# Altium schematic sheet MotorControl.back.SchDoc
size A
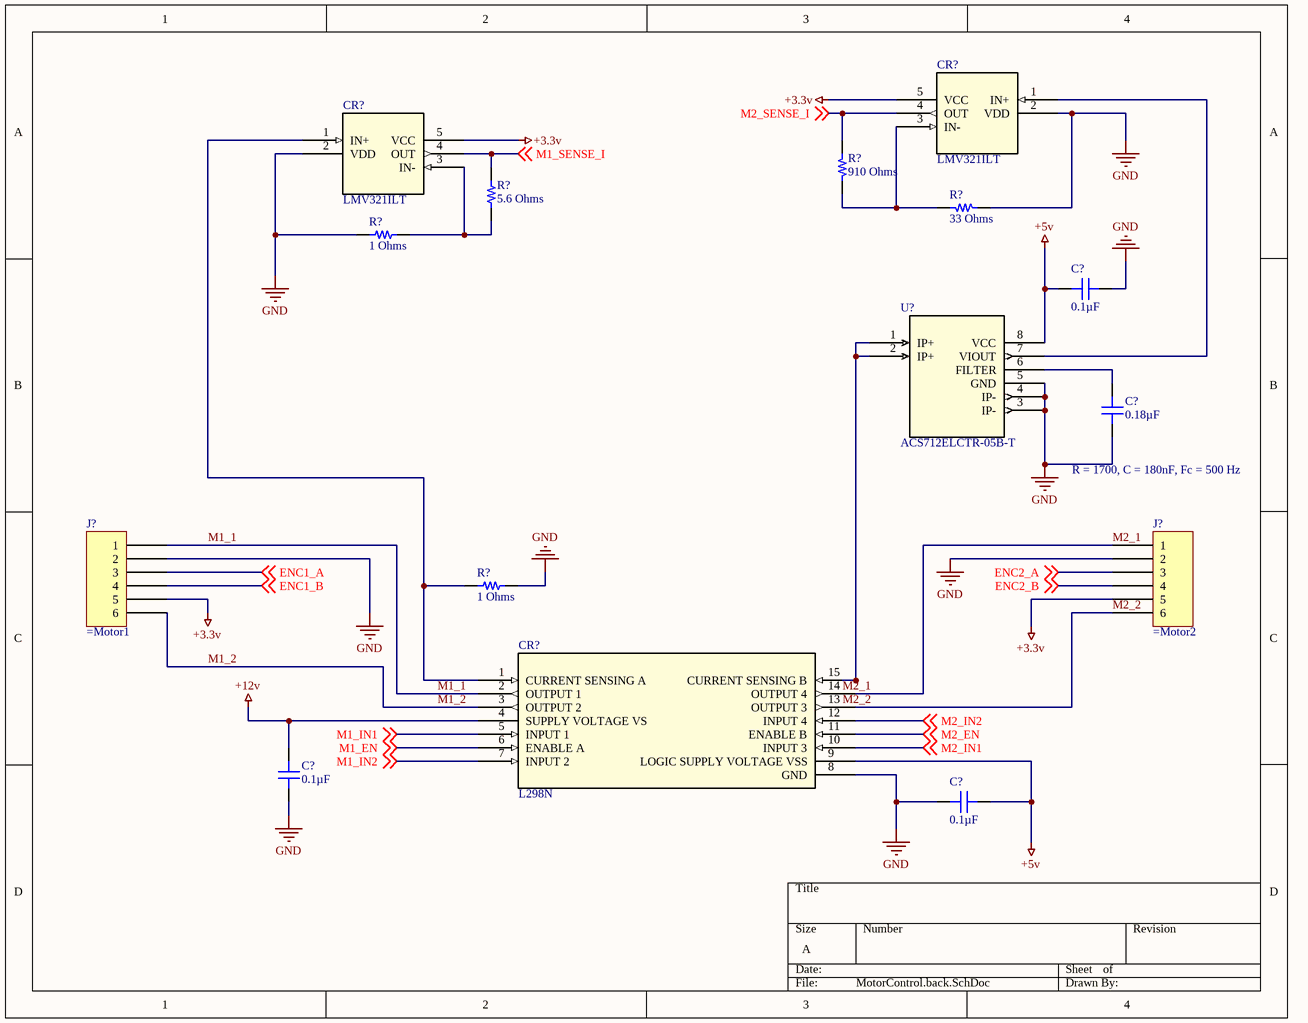
[diagram p0: MotorControl.back.SchDoc]

## Parts
(Parts that share a designator on the sheet are numbered #1, #2 ... from top to bottom, then left to right.)
C?#1  0.1µF  [CAP 0805_2012]
C?#2  0.18µF  [CAP 0805_2012]
C?#3  0.1µF  [CAP 0805_2012]
C?#4  0.1µF  [CAP 0805_2012]
CR?#1  LMV321ILT  [SOT23-5_STM]
CR?#2  LMV321ILT  [SOT23-5_STM]
CR?#3  L298N  [Multiwatt15_V_STM]
J?#1  (no value)  [MOLEX KK 0022272061]
J?#2  (no value)  [MOLEX KK 0022272061]
R?#1  910 Ohms  [RES 0805_2012]
R?#2  5.6 Ohms  [RES 0805_2012]
R?#3  33 Ohms  [RES 0805_2012]
R?#4  1 Ohms  [RES 0805_2012]
R?#5  1 Ohms  [RES 2512_6432]
U?  ACS712ELCTR-05B-T  [SOIC-8_ALM]

## Nets
+3.3v: CR?#1.5(VCC) CR?#2.5(VCC) J?#1.5 J?#2.5
+5v: C?#1.2 C?#4.2 CR?#3.9(LOGIC_SUPPLY_VOLTAGE_VSS) U?.8(VCC)
+12v: C?#3.2 CR?#3.4(SUPPLY_VOLTAGE_VS)
GND: C?#1.1 C?#2.1 C?#3.1 C?#4.1 CR?#1.2(VDD) CR?#2.2(VDD) CR?#3.8(GND) J?#1.2 J?#2.2 R?#3.2 R?#4.1 R?#5.1 U?.3(IP-) U?.4(IP-) U?.5(GND)
ENC1_A: J?#1.3 ; off-sheet ENC1_A
ENC1_B: J?#1.4 ; off-sheet ENC1_B
ENC2_A: J?#2.3 ; off-sheet ENC2_A
ENC2_B: J?#2.4 ; off-sheet ENC2_B
M1_1: CR?#3.2(OUTPUT_1) J?#1.1
M1_2: CR?#3.3(OUTPUT_2) J?#1.6
M1_EN: CR?#3.6(ENABLE_A) ; off-sheet M1_EN
M1_IN1: CR?#3.5(INPUT_1) ; off-sheet M1_IN1
M1_IN2: CR?#3.7(INPUT_2) ; off-sheet M1_IN2
M1_SENSE_I: CR?#2.4(OUT) R?#2.2 ; off-sheet M1_SENSE_I
M2_1: CR?#3.14(OUTPUT_4) J?#2.1
M2_2: CR?#3.13(OUTPUT_3) J?#2.6
M2_EN: CR?#3.11(ENABLE_B) ; off-sheet M2_EN
M2_IN1: CR?#3.10(INPUT_3) ; off-sheet M2_IN1
M2_IN2: CR?#3.12(INPUT_4) ; off-sheet M2_IN2
M2_SENSE_I: CR?#1.4(OUT) R?#1.2 ; off-sheet M2_SENSE_I
NetC?#2_2: C?#2.2 U?.6(FILTER)
NetCR?#1_1: CR?#1.1(IN+) U?.7(VIOUT)
NetCR?#1_3: CR?#1.3(IN-) R?#1.1 R?#3.1
NetCR?#2_1: CR?#2.1(IN+) CR?#3.1(CURRENT_SENSING_A) R?#5.2
NetCR?#2_3: CR?#2.3(IN-) R?#2.1 R?#4.2
NetCR?#3_15: CR?#3.15(CURRENT_SENSING_B) U?.1(IP+) U?.2(IP+)

## Notes on the sheet
- (near C?#2) R = 1700, C = 180nF, Fc = 500 Hz
- Labels drawn without touching a wire or pin: M2_1, M2_2

## Library data of the parts
C?#1 C?#3 C?#4 = CC0805MRX7R9BB104: CAP CER 0.1UF 50V X7R 0805; Manufacturer: Yageo; Tolerance: ±20%; Part Number: CC0805MRX7R9BB104; Value: 0.1µF; Applications: General Purpose; Capacitance: 0.1µF; ComponentLink1Description: Datasheet; ComponentLink1URL: https://www.yageo.com/upload/media/product/productsearch/datasheet/mlcc/UPY-GPHC_X7R_6.3V-to-50V_18.pdf; ComponentLink2Description: DigiKey Link; ComponentLink2URL: http://digikey.com/product-detail/en/yageo/CC0805MRX7R9BB104/311-4351-1-ND/8025440; Device Package: 0805 (2012 Metric); LastUpdated: 9/2/2020 1:04:42 AM; Lifecycle Status: Active; Minimum Order: 1; Mounting Type: Surface Mount, MLCC; Operating Temperature: -55°C ~ 125°C; Package / Case: 0805 (2012 Metric); Packaging: TapeAndReel; PartId: 2475; Part Status: Active; Price: 0.02; Series: CC; Size / Dimension: 0.079" L x 0.049" W (2.00mm x 1.25mm); Supplier 1: DigiKey; Supplier Part Number 1: 311-4351-1-ND; Temperature Coefficient: X7R; Thickness (Max): 0.037" (0.95mm); Voltage - Rated: 50V
C?#2 = C0805C184K4RAC7800: CAP CER 0.18UF 16V X7R 0805; Manufacturer: KEMET; Tolerance: ±10%; Part Number: C0805C184K4RAC7800; Value: 0.18µF; Applications: Bypass, Decoupling; Capacitance: 0.18µF; ComponentLink1Description: Datasheet; ComponentLink1URL: https://api.kemet.com/component-edge/download/datasheet/C0805C184K4RACTU.pdf; ComponentLink2Description: DigiKey Link; ComponentLink2URL: http://digikey.com/product-detail/en/kemet/C0805C184K4RAC7800/399-15463-1-ND/7386861; Device Package: 0805 (2012 Metric); LastUpdated: 9/2/2020 1:04:23 AM; Lifecycle Status: Active; Minimum Order: 1; Mounting Type: Surface Mount, MLCC; Operating Temperature: -55°C ~ 125°C; Package / Case: 0805 (2012 Metric); Packaging: TapeAndReel; PartId: 12515; Part Status: Active; Price: 0.13; Series: SMD Comm X7R; Size / Dimension: 0.079" L x 0.049" W (2.00mm x 1.25mm); Supplier 1: DigiKey; Supplier Part Number 1: 399-15463-1-ND; Temperature Coefficient: X7R; Thickness (Max): 0.035" (0.88mm); Voltage - Rated: 16V
CR?#1 CR?#2 = LMV321ILT: No Description Available; SourceLibrary: Update_to_database_2020-12-04; Built_By: EMA_UL_Team; Vendor: STMicroelectronics; Type: DEV; Manufacturer_Part_Number: LMV321ILT; Copyright: Copyright (C) 2018 Accelerated Designs. All rights reserved; RefDes: RefDes
CR?#3 = L298N: No Description Available; SourceLibrary: Updates_to_database_2020-11-02; Built_By: EMA_UL_Team; Vendor: STMicroelectronics; Type: DEV; Manufacturer_Part_Number: L298N; Copyright: Copyright (C) 2018 Accelerated Designs. All rights reserved; RefDes: RefDes
J?#1 J?#2 = 0022272061: CONN HEADER VERT 6POS 2.54MM; Manufacturer: Molex; Contact Length - Mating: 0.295" (7.49mm); Contact Length - Post: 0.140" (3.56mm); Material Flammability Rating: UL94 V-0; Number of Positions: 6; Number of Positions Loaded: All; Overall Contact Length: 0.560" (14.22mm); Pitch - Mating: 0.100" (2.54mm); Shrouding: Shrouded - 1 Wall; Style: Board to Cable/Wire; Part Number: 0022272061; ComponentLink1Description: Datasheet; ComponentLink1URL: https://www.molex.com/pdm_docs/sd/022272061_sd.pdf; ComponentLink2Description: DigiKey Link; ComponentLink2URL: http://digikey.com/product-detail/en/molex/0022272061/WM4115-ND/1130581; Connector Type: Header; Contact Finish - Mating: Tin; Contact Finish - Post: Tin; Contact Finish Thickness - Mating: 100.0µin (2.54µm); Contact Material: Brass; Contact Shape: Square; Contact Type: Male Pin; Fastening Type: Friction Lock; Insulation Color: Natural; Insulation Height: 0.461" (11.70mm); Insulation Material: Polyamide (PA), Nylon; LastUpdated: 1/12/2020 11:52:24 PM; Lifecycle Status: Active; Minimum Order: 1; Mounting Type: Through Hole; Number of Rows: 1; Packaging: Bulk; PartId: 80; Part Status: Active; Price: 0.49; Series: KK 6410; Supplier 1: DigiKey; Supplier Part Number 1: WM4115-ND; Termination: Solder
R?#1 = CRCW0805910RFKEA: RES SMD 910 OHM 1% 1/8W 0805; Manufacturer: Vishay Dale; Power (Watts): 0.125W, 1/8W; Temperature Coefficient: ±100ppm/°C; Part Number: CRCW0805910RFKEA; Value: 910 Ohms; ComponentLink1Description: Datasheet; ComponentLink1URL: http://www.vishay.com/docs/20035/dcrcwe3.pdf; ComponentLink2Description: DigiKey Link; ComponentLink2URL: http://digikey.com/product-detail/en/vishay-dale/CRCW0805910RFKEA/541-910CCT-ND/1180779; Composition: Thick Film; Device Package: 0805 (2012 Metric); Features: Automotive AEC-Q200; Height - Seated (Max): 0.020" (0.50mm); LastUpdated: 9/2/2020 1:15:22 AM; Lifecycle Status: Active; Minimum Order: 1; Number of Terminations: 2; Operating Temperature: -55°C ~ 155°C; Package / Case: 0805 (2012 Metric); Packaging: TapeAndReel; PartId: 28579; Part Status: Active; Price: 0.01; Ratings: AEC-Q200; Resistance: 910 Ohms; Series: CRCW; Size / Dimension: 0.079" L x 0.049" W (2.00mm x 1.25mm); Supplier 1: DigiKey; Supplier Part Number 1: 541-910CCT-ND; Supplier Device Package: 0805; Tolerance: ±1%
R?#2 = CRCW08055R60FKEA: RES SMD 5.6 OHM 1% 1/8W 0805; Manufacturer: Vishay Dale; Power (Watts): 0.125W, 1/8W; Temperature Coefficient: ±100ppm/°C; Part Number: CRCW08055R60FKEA; Value: 5.6 Ohms; ComponentLink1Description: Datasheet; ComponentLink1URL: http://www.vishay.com/docs/20035/dcrcwe3.pdf; ComponentLink2Description: DigiKey Link; ComponentLink2URL: http://digikey.com/product-detail/en/vishay-dale/CRCW08055R60FKEA/541-5.60CCCT-ND/1962196; Composition: Thick Film; Device Package: 0805 (2012 Metric); Features: Automotive AEC-Q200; Height - Seated (Max): 0.020" (0.50mm); LastUpdated: 9/2/2020 1:14:44 AM; Lifecycle Status: Active; Minimum Order: 1; Number of Terminations: 2; Operating Temperature: -55°C ~ 155°C; Package / Case: 0805 (2012 Metric); Packaging: TapeAndReel; PartId: 45796; Part Status: Active; Price: 0.01; Ratings: AEC-Q200; Resistance: 5.6 Ohms; Series: CRCW; Size / Dimension: 0.079" L x 0.049" W (2.00mm x 1.25mm); Supplier 1: DigiKey; Supplier Part Number 1: 541-5.60CCCT-ND; Supplier Device Package: 0805; Tolerance: ±1%
R?#3 = RMCF0805FT33R0: RES 33 OHM 1% 1/8W 0805; Manufacturer: Stackpole Electronics Inc; Power (Watts): 0.125W, 1/8W; Temperature Coefficient: ±100ppm/°C; Part Number: RMCF0805FT33R0; Value: 33 Ohms; ComponentLink1Description: Datasheet; ComponentLink1URL: https://www.seielect.com/catalog/sei-packaging.pdf; ComponentLink2Description: DigiKey Link; ComponentLink2URL: http://digikey.com/product-detail/en/stackpole-electronics-inc/RMCF0805FT33R0/RMCF0805FT33R0CT-ND/2418366; Composition: Thick Film; Device Package: 0805 (2012 Metric); Features: Automotive AEC-Q200; Height - Seated (Max): 0.026" (0.65mm); LastUpdated: 9/2/2020 1:15:14 AM; Lifecycle Status: Active; Minimum Order: 1; Number of Terminations: 2; Operating Temperature: -55°C ~ 155°C; Package / Case: 0805 (2012 Metric); Packaging: CutTape; PartId: 32453; Part Status: Active; Price: 0.10; Ratings: AEC-Q200; Resistance: 33 Ohms; Series: RMCF; Size / Dimension: 0.079" L x 0.049" W (2.00mm x 1.25mm); Supplier 1: DigiKey; Supplier Part Number 1: RMCF0805FT33R0CT-ND; Supplier Device Package: 0805; Tolerance: ±1%
R?#4 = ERJ-6RQF1R0V: RES SMD 1 OHM 1% 1/8W 0805; Manufacturer: Panasonic Electronic Components; Power (Watts): 0.125W, 1/8W; Temperature Coefficient: ±200ppm/°C; Part Number: ERJ-6RQF1R0V; Value: 1 Ohms; ComponentLink1Description: Datasheet; ComponentLink1URL: https://industrial.panasonic.com/cdbs/www-data/pdf/RDN0000/AOA0000C313.pdf; ComponentLink2Description: DigiKey Link; ComponentLink2URL: http://digikey.com/product-detail/en/panasonic-electronic-components/ERJ-6RQF1R0V/P1.0DCT-ND/250289; Composition: Thick Film; Device Package: 0805 (2012 Metric); Features: Automotive AEC-Q200, Current Sense; Height - Seated (Max): 0.028" (0.70mm); LastUpdated: 9/2/2020 1:15:22 AM; Lifecycle Status: Active; Minimum Order: 1; Number of Terminations: 2; Operating Temperature: -55°C ~ 125°C; Package / Case: 0805 (2012 Metric); Packaging: TapeAndReel; PartId: 28426; Part Status: Active; Price: 0.04; Ratings: AEC-Q200; Resistance: 1 Ohms; Series: ERJ; Size / Dimension: 0.079" L x 0.049" W (2.00mm x 1.25mm); Supplier 1: DigiKey; Supplier Part Number 1: P1.0DCT-ND; Supplier Device Package: 0805; Tolerance: ±1%
R?#5 = SR733ATTE1R00F: RES 1 OHM 1% 1W 2512; Manufacturer: KOA Speer Electronics, Inc.; Temperature Coefficient: ±100ppm/°C; Part Number: SR733ATTE1R00F; ComponentLink1Description: Datasheet; ComponentLink1URL: http://www.koaspeer.com/catimages/Products/SR73/SR73.pdf; ComponentLink2Description: DigiKey Link; ComponentLink2URL: http://digikey.com/product-detail/en/koa-speer-electronics-inc/SR733ATTE1R00F/2019-SR733ATTE1R00FCT-ND/9847697; Composition: Thick Film; Device Package: 2512 (6432 Metric); Features: Automotive AEC-Q200, Current Sense; Height - Seated (Max): 0.024" (0.60mm); LastUpdated: 9/2/2020 1:26:56 AM; Lifecycle Status: Active; Minimum Order: 1; Number of Terminations: 2; Operating Temperature: -55°C ~ 150°C; Package / Case: 2512 (6432 Metric); Packaging: TapeAndReel; Part Status: Active; Power (Watts): 1W; Price: 0.23; Ratings: AEC-Q200; Resistance: 1 Ohms; Series: SR73; Size / Dimension: 0.248" L x 0.122" W (6.30mm x 3.10mm); Supplier 1: DigiKey; Supplier Part Number 1: 2019-SR733ATTE1R00FCT-ND; Supplier Device Package: 2512; Tolerance: ±1%; Value: 1 Ohms
U? = ACS712ELCTR-05B-T: No Description Available; Vendor: Allegro Microsystems Inc.; Built_By: EMA_UL_Team; SourceLibrary: Allegro_2014-07-30; Manufacturer_Part_Number: ACS712ELCTR-05B-T; Copyright: Copyright (C) 2018 Accelerated Designs. All rights reserved; RefDes: RefDes; Type: DEV